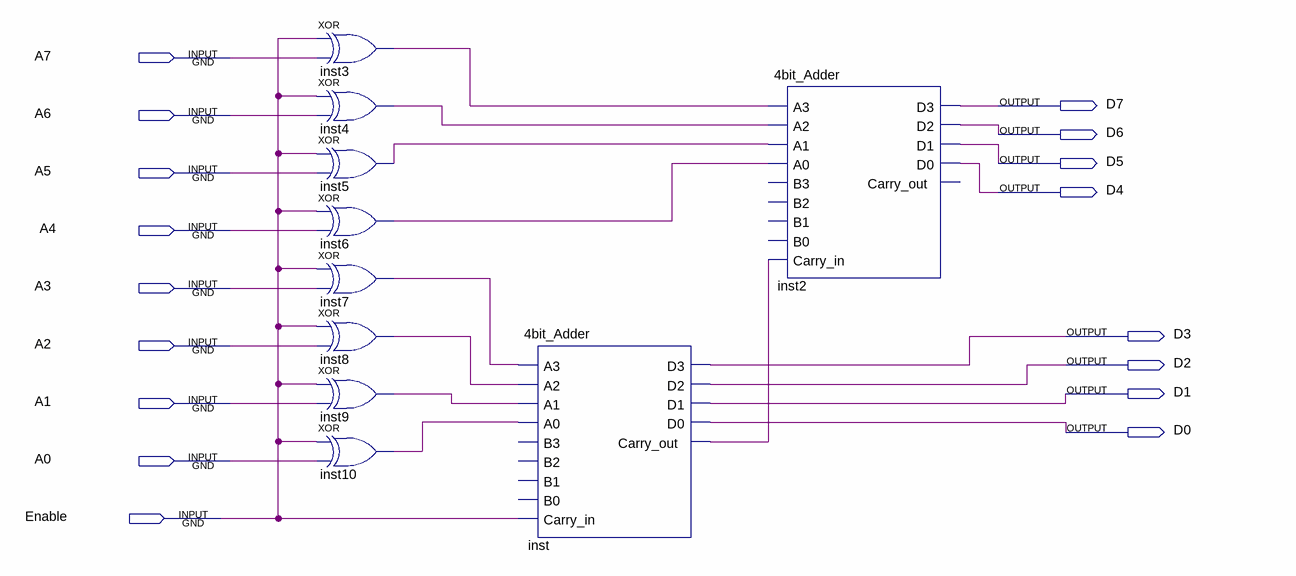
[diagram p0: schematic sheet]
// Quartus schematic Negate.bdf as structural Verilog: 10 symbols, 17 pins
module Negate (
  input  A7,
  input  A6,
  input  A5,
  input  A4,
  input  A3,
  input  A2,
  input  A1,
  input  A0,
  input  Enable,
  output D7,
  output D6,
  output D5,
  output D4,
  output D3,
  output D2,
  output D1,
  output D0
);

  wire inst3_out, inst4_out, inst5_out, inst6_out, inst7_out, inst8_out, inst9_out, inst10_out,
       inst_carry_out;

  xor inst3 (inst3_out, Enable, A7);
  xor inst4 (inst4_out, Enable, A6);
  xor inst5 (inst5_out, Enable, A5);
  xor inst6 (inst6_out, Enable, A4);
  xor inst7 (inst7_out, Enable, A3);
  xor inst8 (inst8_out, Enable, A2);
  xor inst9 (inst9_out, Enable, A1);
  xor inst10 (inst10_out, Enable, A0);
  \4bit_Adder  inst (
    .A3(inst7_out), .A2(inst8_out), .A1(inst9_out), .A0(inst10_out), .Carry_in(Enable), .D3(D3), .D2(D2),
    .D1(D1), .D0(D0), .Carry_out(inst_carry_out));  // open: B3, B2, B1, B0
  \4bit_Adder  inst2 (
    .A3(inst3_out), .A2(inst4_out), .A1(inst5_out), .A0(inst6_out), .Carry_in(inst_carry_out), .D3(D7),
    .D2(D6), .D1(D5), .D0(D4));  // open: B3, B2, B1, B0, Carry_out
endmodule
